# EAGLE board Mainboard_LEFT (EAGLE 9.6.2), part 1 of 3
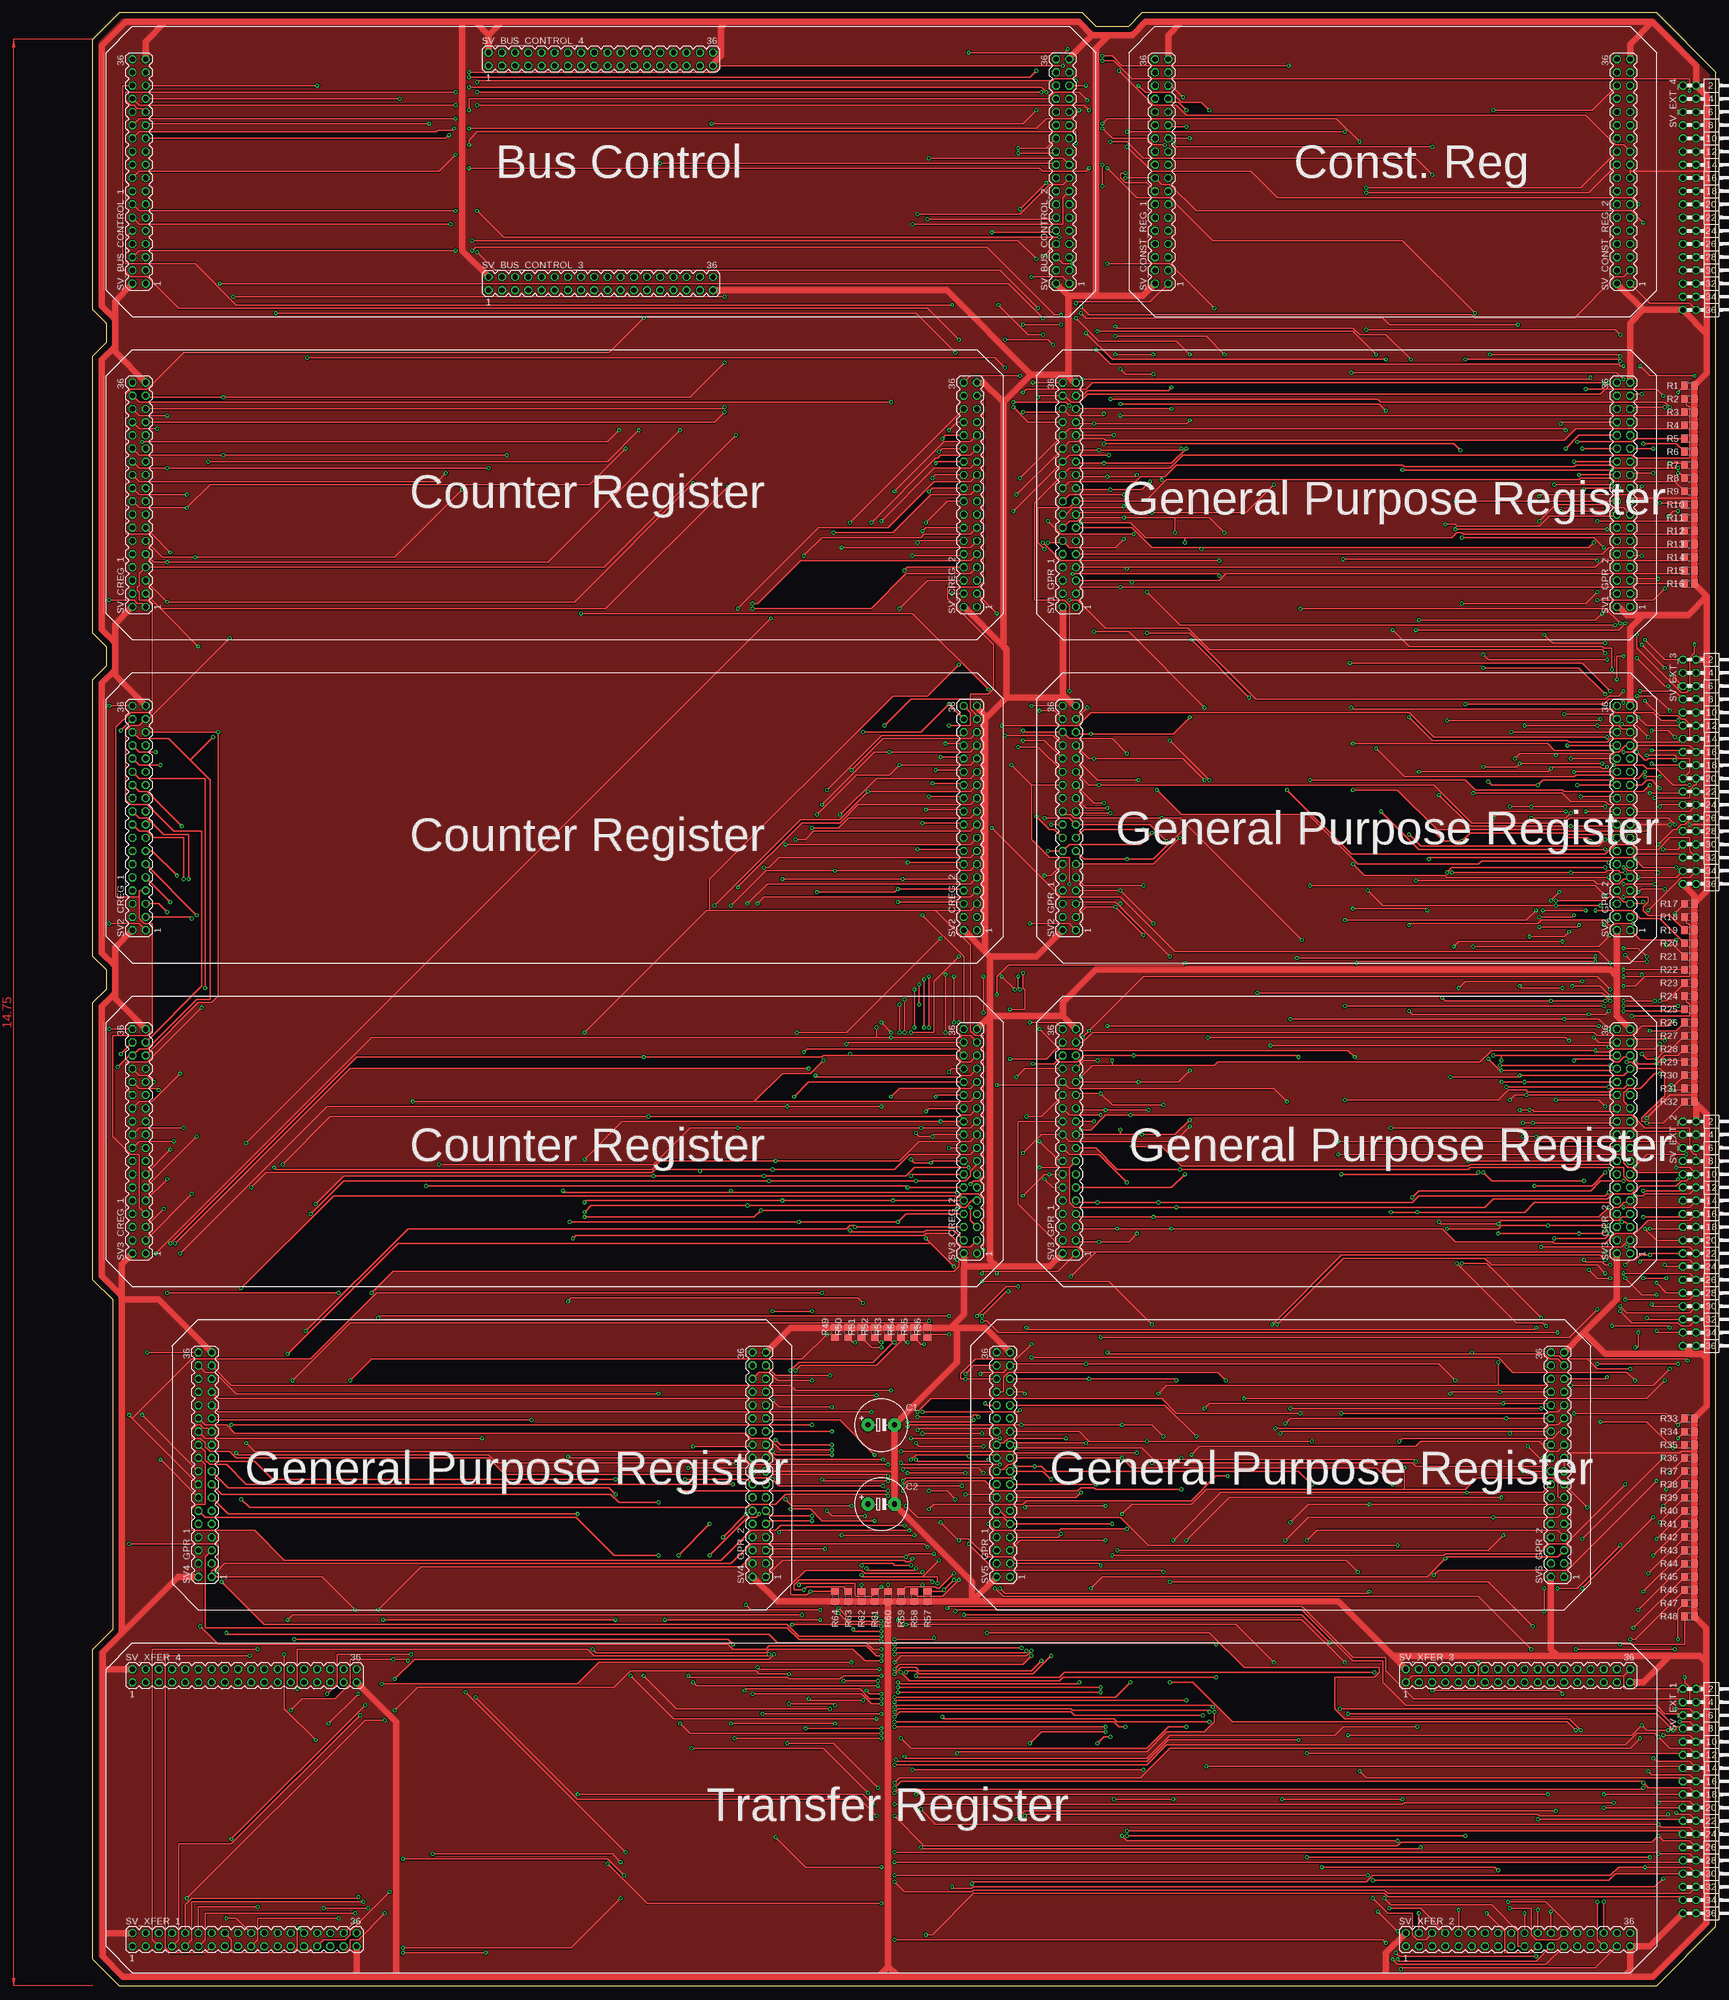
[diagram p2: board, top side]
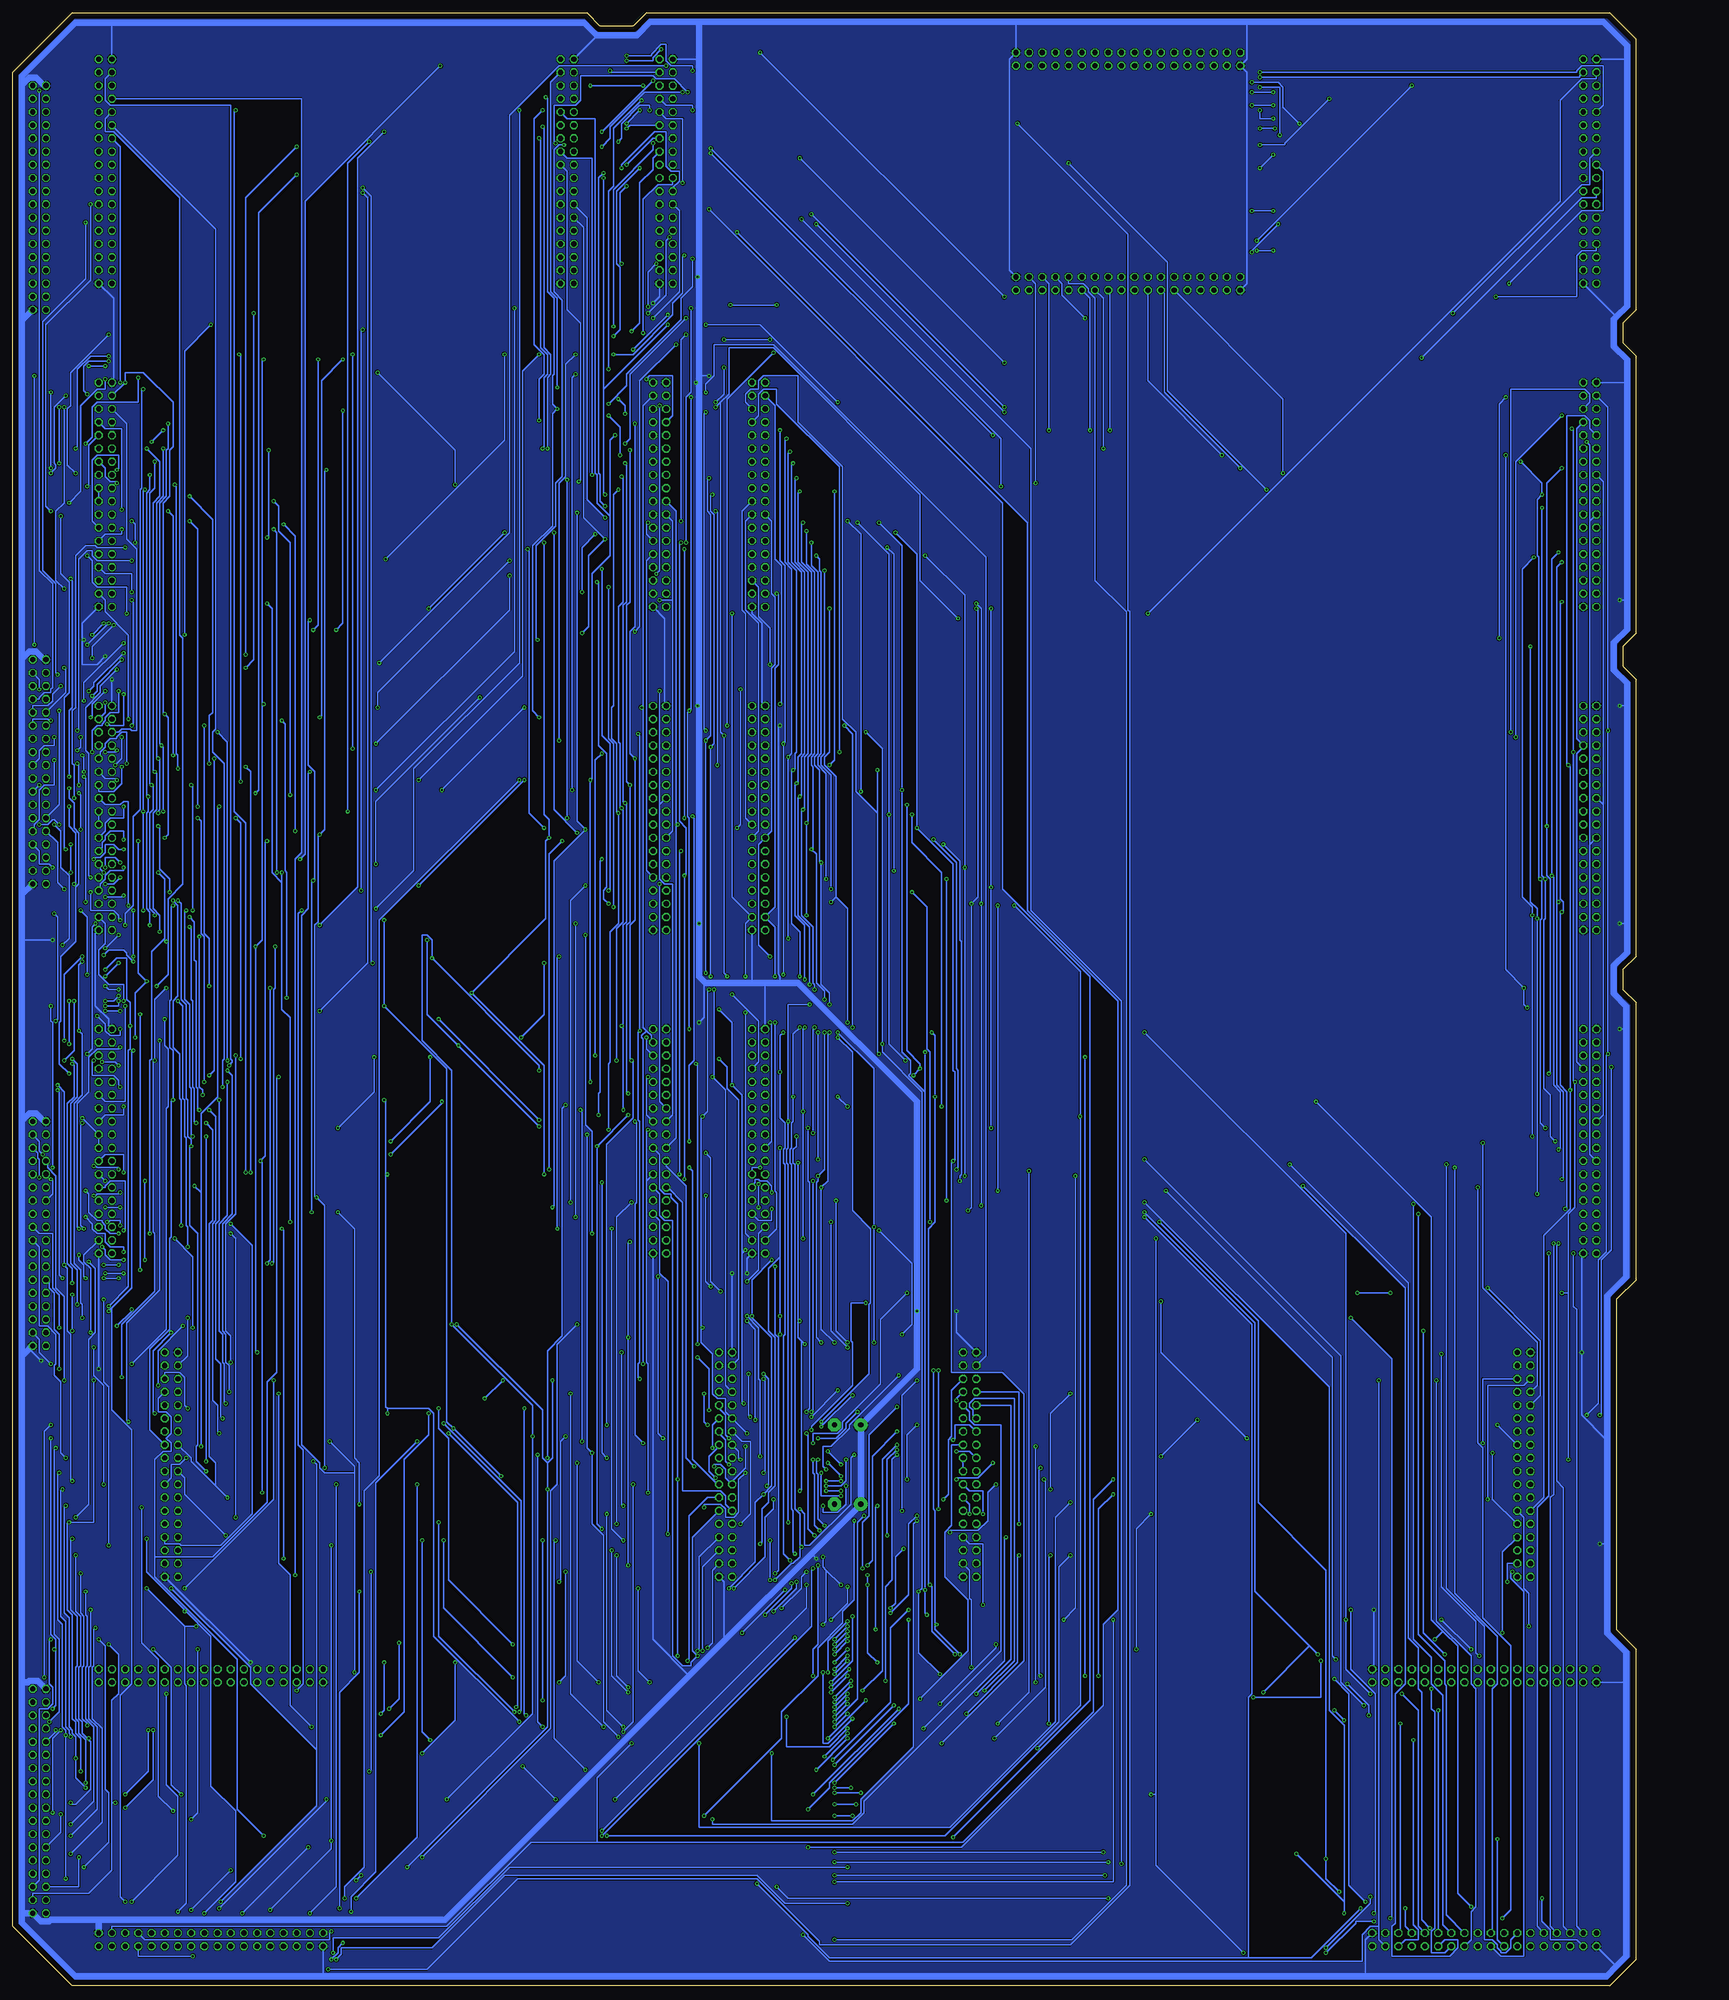
[diagram p3: board, bottom side, seen from below]

Size 312.42 x 379.73 mm. Coordinates in mm from the lower left corner, seen from the top.
Outline: 5.08,0 300.99,0 312.42,11.43 312.42,368.3 300.99,379.73 201.93,379.73 199.39,377.19 193.04,377.19 190.5,379.73 5.08,379.73 0,374.65 0,322.58 2.54,320.04 2.54,316.23 0,313.69 0,260.35 2.54,257.81 2.54,254 0,251.46 0,198.12 2.54,195.58 2.54,191.77 0,189.23 0,135.89 3.81,132.08 3.81,68.58 0,64.77 0,5.08 5.08,0
Copper layers (1*16): Top 0.035mm / dielectric 1.5mm / Bottom 0.035mm
Design rules "default *": minimum track width 10mil, minimum drill 0.35mm, track to track 6mil, track to pad 6mil, pad to pad 6mil, via to via 6mil, smd to smd 6mil, copper to edge 40mil, drill to drill 6mil, minimum pad ring 10mil, minimum via ring 8mil, stop-mask expansion 4mil, vias tented up to drill 0mil, thermal gap 10mil

## Footprints (pad centres in the part's own frame; a part is rotated, then mirrored left to right if it is on the bottom)
E5-10,5 = drill 1.016 pad 2.54: + -2.54,0 | drill 1.016 pad 2.54 octagon: - 2.54,0
R0805 = smd 1.3 x 1.5: 1 -0.95,0; 2 0.95,0
MA18-2 = drill 1.016 octagon: 1 -21.59,-1.27; 2 -21.59,1.27; 3 -19.05,-1.27; 4 -19.05,1.27; 5 -16.51,-1.27; 6 -16.51,1.27; 7 -13.97,-1.27; 8 -13.97,1.27; 9 -11.43,-1.27; 10 -11.43,1.27; 11 -8.89,-1.27; 12 -8.89,1.27; 13 -6.35,-1.27; 14 -6.35,1.27; 15 -3.81,-1.27; 16 -3.81,1.27; 17 -1.27,-1.27; 18 -1.27,1.27; 19 1.27,-1.27; 20 1.27,1.27; 21 3.81,-1.27; 22 3.81,1.27; 23 6.35,-1.27; 24 6.35,1.27; 25 8.89,-1.27; 26 8.89,1.27; 27 11.43,-1.27; 28 11.43,1.27; 29 13.97,-1.27; 30 13.97,1.27; 31 16.51,-1.27; 32 16.51,1.27; 33 19.05,-1.27; 34 19.05,1.27; 35 21.59,-1.27; 36 21.59,1.27
MA18-2W = drill 1.016 octagon: 1 -21.59,-1.27; 2 -21.59,1.27; 3 -19.05,-1.27; 4 -19.05,1.27; 5 -16.51,-1.27; 6 -16.51,1.27; 7 -13.97,-1.27; 8 -13.97,1.27; 9 -11.43,-1.27; 10 -11.43,1.27; 11 -8.89,-1.27; 12 -8.89,1.27; 13 -6.35,-1.27; 14 -6.35,1.27; 15 -3.81,-1.27; 16 -3.81,1.27; 17 -1.27,-1.27; 18 -1.27,1.27; 19 1.27,-1.27; 20 1.27,1.27; 21 3.81,-1.27; 22 3.81,1.27; 23 6.35,-1.27; 24 6.35,1.27; 25 8.89,-1.27; 26 8.89,1.27; 27 11.43,-1.27; 28 11.43,1.27; 29 13.97,-1.27; 30 13.97,1.27; 31 16.51,-1.27; 32 16.51,1.27; 33 19.05,-1.27; 34 19.05,1.27; 35 21.59,-1.27; 36 21.59,1.27

## Placement (x,y rotation side)
C1  [E5-10,5]  151.76,107.95 0 top
C2  [E5-10,5]  151.76,92.71 0 top
R1  [R0805]  307.34,307.98 0 top
R2  [R0805]  307.34,305.44 0 top
R3  [R0805]  307.34,302.89 0 top
R4  [R0805]  307.34,300.36 0 top
R5  [R0805]  307.34,297.81 0 top
R6  [R0805]  307.34,295.27 0 top
R7  [R0805]  307.34,292.74 0 top
R8  [R0805]  307.34,290.19 0 top
R9  [R0805]  307.34,287.65 0 top
R10  [R0805]  307.34,285.12 0 top
R11  [R0805]  307.34,282.57 0 top
R12  [R0805]  307.34,280.04 0 top
R13  [R0805]  307.34,277.5 0 top
R14  [R0805]  307.34,274.95 0 top
R15  [R0805]  307.34,272.42 0 top
R16  [R0805]  307.34,269.88 0 top
R17  [R0805]  307.34,208.28 0 top
R18  [R0805]  307.34,205.74 0 top
R19  [R0805]  307.34,203.2 0 top
R20  [R0805]  307.34,200.66 0 top
R21  [R0805]  307.34,198.12 0 top
R22  [R0805]  307.34,195.58 0 top
R23  [R0805]  307.34,193.04 0 top
R24  [R0805]  307.34,190.5 0 top
R25  [R0805]  307.34,187.96 0 top
R26  [R0805]  307.34,185.42 0 top
R27  [R0805]  307.34,182.88 0 top
R28  [R0805]  307.34,180.34 0 top
R29  [R0805]  307.34,177.8 0 top
R30  [R0805]  307.34,175.26 0 top
R31  [R0805]  307.34,172.72 0 top
R32  [R0805]  307.34,170.18 0 top
R33  [R0805]  307.34,109.22 0 top
R34  [R0805]  307.34,106.68 0 top
R35  [R0805]  307.34,104.14 0 top
R36  [R0805]  307.34,101.6 0 top
R37  [R0805]  307.34,99.06 0 top
R38  [R0805]  307.34,96.52 0 top
R39  [R0805]  307.34,93.98 0 top
R40  [R0805]  307.34,91.44 0 top
R41  [R0805]  307.34,88.9 0 top
R42  [R0805]  307.34,86.36 0 top
R43  [R0805]  307.34,83.82 0 top
R44  [R0805]  307.34,81.28 0 top
R45  [R0805]  307.34,78.74 0 top
R46  [R0805]  307.34,76.2 0 top
R47  [R0805]  307.34,73.66 0 top
R48  [R0805]  307.34,71.12 0 top
R49  [R0805]  142.88,125.73 90 top
R50  [R0805]  145.41,125.73 90 top
R51  [R0805]  147.96,125.73 90 top
R52  [R0805]  150.5,125.73 90 top
R53  [R0805]  153.03,125.73 90 top
R54  [R0805]  155.57,125.73 90 top
R55  [R0805]  158.12,125.73 90 top
R56  [R0805]  160.66,125.73 90 top
R57  [R0805]  160.66,74.93 270 top
R58  [R0805]  158.12,74.93 270 top
R59  [R0805]  155.57,74.93 270 top
R60  [R0805]  153.03,74.93 270 top
R61  [R0805]  150.5,74.93 270 top
R62  [R0805]  147.96,74.93 270 top
R63  [R0805]  145.41,74.93 270 top
R64  [R0805]  142.88,74.93 270 top
SV1_GPR_1  [MA18-2]  187.96,287.02 90 top
SV1_GPR_2  [MA18-2]  294.64,287.02 90 top
SV2_CREG_1  [MA18-2]  8.89,224.79 90 top
SV2_CREG_2  [MA18-2]  168.91,224.79 90 top
SV2_GPR_1  [MA18-2]  187.96,224.79 90 top
SV2_GPR_2  [MA18-2]  294.64,224.79 90 top
SV3_CREG_1  [MA18-2]  8.89,162.56 90 top
SV3_CREG_2  [MA18-2]  168.91,162.56 90 top
SV3_GPR_1  [MA18-2]  187.96,162.56 90 top
SV3_GPR_2  [MA18-2]  294.64,162.56 90 top
SV4_GPR_1  [MA18-2]  21.59,100.33 90 top
SV4_GPR_2  [MA18-2]  128.27,100.33 90 top
SV5_GPR_1  [MA18-2]  175.26,100.33 90 top
SV5_GPR_2  [MA18-2]  281.94,100.33 90 top
SV_BUS_CONTROL_1  [MA18-2]  8.89,349.25 90 top
SV_BUS_CONTROL_2  [MA18-2]  186.69,349.25 90 top
SV_BUS_CONTROL_3  [MA18-2]  97.79,327.66 0 top
SV_BUS_CONTROL_4  [MA18-2]  97.79,370.84 0 top
SV_CONST_REG_1  [MA18-2]  205.74,349.25 90 top
SV_CONST_REG_2  [MA18-2]  294.64,349.25 90 top
SV_CREG_1  [MA18-2]  8.89,287.02 90 top
SV_CREG_2  [MA18-2]  168.91,287.02 90 top
SV_EXT_1  [MA18-2W]  307.34,35.56 270 top
SV_EXT_2  [MA18-2W]  307.34,144.78 270 top
SV_EXT_3  [MA18-2W]  307.34,233.68 270 top
SV_EXT_4  [MA18-2W]  307.34,344.17 270 top
SV_XFER_1  [MA18-2]  29.21,8.89 0 top
SV_XFER_2  [MA18-2]  274.32,8.89 0 top
SV_XFER_3  [MA18-2]  274.32,59.69 0 top
SV_XFER_4  [MA18-2]  29.21,59.69 0 top

## Tracks (layer width: path | path; a pad name or v marks a point on that pad's centre or on a via)
!CLK  (via drill 0.35)
  Top 0.254: SV_CONST_REG_1.16 202.88,347.03 198.75,347.03 197.8,347.98 197.8,348.93 v198.75,348.93 | v198.44,284.8 198.12,284.48 188.59,284.48 187.32,283.21 SV1_GPR_1.16 | SV_EXT_3.7 304.48,249.24 v297.81,249.24 | v291.15,256.54 290.51,257.18 214.95,257.18 210.82,261.3 194.94,261.3 189.55,266.7 v187.96,266.7 | v6.99,109.86 7.62,109.22 | 7.62,109.22 SV4_GPR_1.16 | v4.76,176.85 6.99,179.07 SV3_CREG_1.32 8.89,180.34 10.48,180.34 20,189.87 22.54,189.87 22.54,232.09 18.73,235.9 | SV2_CREG_1.32 8.89,240.03 14.61,240.03 18.73,235.9 | SV_CREG_1.32 8.89,302.26 v14.29,302.26 | 18.73,235.9 v23.18,240.35 | v177.48,100.01 v181.29,100.01 182.56,100.01 183.51,99.06 232.09,99.06 v234.63,96.52 | SV_XFER_2.6 256.54,8.89 254.95,8.89 254,9.84 254,13.97 249.24,13.97 v246.38,16.83 | 7.62,109.22 19.05,120.65 41.91,120.65 54.61,133.35 v140.34,133.35 | v158.43,104.46 159.07,103.82 v171.45,103.82 | SV2_GPR_1.16 185.1,222.57 184.15,222.57 v181.61,225.11 | v182.25,162.56 186.06,158.75 SV3_GPR_1.16
  Bottom 0.254: SV2_GPR_1.16 185.42,222.25 185.42,266.7 | 185.42,266.7 185.42,281.94 SV1_GPR_1.16 | v198.75,348.93 199.71,347.98 199.71,291.15 199.39,290.83 199.39,285.75 v198.44,284.8 | v297.81,249.24 296.86,250.19 296.86,250.82 v291.15,256.54 | 185.42,266.7 v187.96,266.7 | v6.99,109.86 6.67,110.17 6.67,139.7 4.76,141.6 v4.76,176.85 | v14.29,302.26 23.18,293.37 v23.18,240.35 | 174.31,96.84 175.26,97.79 175.26,99.38 176.21,100.33 177.48,100.33 v177.48,100.01 | v181.29,100.01 182.88,101.6 182.88,153.99 186.69,157.8 SV3_GPR_1.16 | v246.38,16.83 234.63,28.57 v234.63,96.52 | v140.34,133.35 145.41,128.27 145.41,115.89 152.72,108.58 152.72,107.31 153.67,106.36 158.43,106.36 v158.43,104.46 | v171.45,103.82 171.45,99.69 174.31,96.84 | 174.31,96.84 SV5_GPR_1.16 | v181.61,225.11 181.29,224.79 181.29,178.12 182.25,177.16 v182.25,162.56
!CONST_REG_ASSERT_MAIN_BUS  (via drill 0.35)
  Top 0.254: v127.95,61.28 128.27,60.96 v151.45,60.96 | v193.99,57.47 v154.94,57.47 | v196.22,82.87 260.03,82.87 260.35,83.19 278.45,83.19 280.35,85.09 283.53,85.09 | 283.53,85.09 284.48,84.14 284.48,81.28 SV5_GPR_2.3 | v297.5,125.73 297.5,122.87 v296.86,122.87 | 283.53,85.09 v294.96,96.52 | v291.15,189.55 v280.67,189.55 260.35,189.55 v259.71,190.18 | v278.76,142.24 294.32,142.24 295.59,143.51 SV3_GPR_2.3 | v290.19,243.84 289.88,243.52 v260.67,243.52
  Bottom 0.254: SV4_GPR_2.3 128.27,80.01 128.27,74.61 127.95,74.3 v127.95,61.28 | v154.94,57.47 v151.45,60.96 | v193.99,57.47 196.22,59.69 v196.22,82.87 | SV3_GPR_2.3 298.77,140.65 298.77,139.38 297.5,138.11 v297.5,125.73 | v296.86,122.87 296.86,117.47 294.96,115.57 v294.96,96.52 | SV2_GPR_2.3 294.64,204.47 294.64,200.66 295.91,199.39 295.91,194.63 294,192.72 291.15,192.72 v291.15,189.55 | v280.67,189.55 279.72,188.59 279.72,170.81 279.4,170.5 279.4,163.51 279.08,163.19 279.08,146.37 278.76,146.05 v278.76,142.24 | SV1_GPR_2.3 294.64,266.7 294.64,264.48 290.19,260.03 v290.19,243.84 | v260.67,243.52 260.03,242.89 260.03,214.63 259.71,214.31 v259.71,190.18
!CONST_REG_LOAD  (via drill 0.35)
  Top 0.254: v137.79,55.24 138.11,54.93 v148.27,54.93 | v155.57,47.62 157.48,45.72 202.88,45.72 207.01,49.85 v210.5,49.85 | v211.46,102.23 213.04,103.82 254.63,103.82 255.59,104.78 278.45,104.78 280.35,102.87 281.94,102.87 SV5_GPR_2.21 | v291.15,169.23 289.88,170.5 v281.62,170.5 | v290.19,207.96 v281.62,207.96 248.28,207.96 v245.43,210.82 | SV1_GPR_2.21 296.23,291.15 v300.36,291.15 | v294,317.82 293.05,318.77 v245.11,318.77
  Bottom 0.254: SV4_GPR_2.21 131.76,104.14 131.76,88.58 133.03,87.31 133.03,78.74 128.59,74.3 128.59,64.45 v137.79,55.24 | v155.57,47.62 v148.27,54.93 | v210.5,49.85 211.46,50.8 v211.46,102.23 | SV3_GPR_2.21 294.64,167.64 291.15,167.64 v291.15,169.23 | SV5_GPR_2.21 286.07,107 286.07,122.56 282.26,126.36 282.26,143.83 281.94,144.15 281.94,170.18 v281.62,170.5 281.62,180.02 282.26,180.66 282.26,189.55 281.94,189.87 281.94,207.65 v281.62,207.96 | SV2_GPR_2.21 294.64,227.33 291.78,227.33 291.15,227.97 290.19,227.97 v290.19,207.96 | v300.36,291.15 301.94,292.74 301.94,303.53 301.31,304.17 301.31,310.51 v294,317.82 | v245.11,318.77 245.43,318.45 v245.43,210.82
!CTRL_ALU_ASSERT  (via drill 0.35)
  Top 0.254: SV_EXT_3.13 305.44,239.4 296.86,239.4 296.23,240.03 292.1,240.03 291.46,239.4 284.16,239.4 283.85,239.71 257.81,239.71 v253.37,244.16 | v248.92,313.06 196.22,313.06 v191.13,318.13
  Bottom 0.254: v253.37,244.16 253.05,244.47 253.05,308.93 v248.92,313.06 | v191.13,318.13 191.13,343.85 188.28,346.71 185.42,346.71 SV_BUS_CONTROL_2.18
!CTRL_CONST_ASSERT  (via drill 0.35)
  Top 0.254: SV_BUS_CONTROL_2.6 186.69,331.47 v188.59,331.47 | v190.18,323.21 191.77,321.63 265.43,321.63 266.06,320.99 285.12,320.99 293.05,328.93 294.64,328.93 SV_CONST_REG_2.3
  Bottom 0.254: v188.59,331.47 190.18,329.88 v190.18,323.21
!CTRL_CONST_LOAD  (via drill 0.35)
  Top 0.254: v197.49,368.62 204.15,361.95 208.6,361.95 210.5,360.05 287.34,360.05 293.05,354.33 294.64,354.33 SV_CONST_REG_2.21
  Bottom 0.254: SV_BUS_CONTROL_2.33 197.49,368.3 v197.49,368.62
!CTRL_CREG_ASSERT_ADDR  (via drill 0.35)
  Top 0.254: v14.92,160.97 SV3_CREG_1.13 | v16.19,213.68 11.43,218.44 SV2_CREG_1.13 | v14.92,275.91 11.43,279.4 | 11.43,279.4 SV_CREG_1.13 | v106.05,320.99 99.38,314.32 17.46,314.32 10.48,307.34 7.3,307.34 6.35,306.39 6.35,279.4 11.43,279.4
  Bottom 0.254: v14.92,160.97 14.61,161.29 14.61,172.09 15.88,173.35 15.88,213.36 v16.19,213.68 16.19,274.64 v14.92,275.91 | SV_BUS_CONTROL_3.30 110.49,327.66 110.49,325.44 v106.05,320.99
!CTRL_CREG_ASSERT_XFER  (via drill 0.35)
  Top 0.254: v20,163.51 SV3_CREG_1.11 | SV2_CREG_1.11 v20,206.06 | SV_CREG_1.11 13.34,274.95 v19.68,274.95 58.1,274.95 v71.12,287.97 | SV_BUS_CONTROL_2.20 185.1,350.84 v109.22,350.84
  Bottom 0.254: v20,163.51 v20,206.06 20,207.65 21.91,209.55 21.91,272.73 v19.68,274.95 | v109.22,350.84 90.17,331.79 90.17,307.02 v71.12,287.97
!CTRL_CREG_DEC  (via drill 0.35)
  Top 0.254: SV3_CREG_1.20 8.89,165.1 v17.46,165.1 | v18.41,213.04 18.41,221.62 13.65,221.62 10.48,224.79 8.89,224.79 SV2_CREG_1.20 | SV_CREG_1.20 8.89,287.02 v18.1,287.02 | v105.09,299.4 99.06,293.37 v22.23,293.37
  Bottom 0.254: v17.46,165.1 18.41,166.05 18.41,205.1 18.1,205.42 18.1,212.72 v18.41,213.04 18.73,213.36 18.73,274.95 19.05,275.27 19.05,286.07 v18.1,287.02 18.1,289.24 v22.23,293.37 | SV_BUS_CONTROL_3.25 105.09,324.8 v105.09,299.4
!CTRL_CREG_INC  (via drill 0.35)
  Top 0.254: SV3_CREG_1.26 6.35,172.72 6.35,177.8 10.48,177.8 v20.95,188.28 | v21.59,192.09 21.59,232.41 8.89,232.41 SV2_CREG_1.26 | SV_CREG_1.26 8.89,294.64 v25.08,294.64 v79.69,294.64
  Bottom 0.254: v20.95,188.28 21.59,188.91 v21.59,192.09 25.08,195.58 v25.08,294.64 | v79.69,294.64 93.98,308.93 SV_BUS_CONTROL_3.15
!CTRL_CREG_LOAD_XFER  (via drill 0.35)
  Top 0.254: SV3_CREG_1.33 20.95,192.41 20.95,222.25 15.56,222.25 10.48,227.33 7.3,227.33 6.35,228.28 6.35,241.94 6.67,241.94 7.3,242.57 8.89,242.57 SV2_CREG_1.33 10.79,243.84 v26.35,259.4 | SV_CREG_1.33 10.48,305.75 v25.08,305.75 114.94,305.75 v121.6,312.42 | SV_BUS_CONTROL_2.19 186.69,351.79 v160.97,351.79
  Bottom 0.254: v25.08,305.75 26.35,304.48 v26.35,259.4 | v121.6,312.42 v160.97,351.79
!CTRL_DPLY_ENABLE  (via drill 0.35)
  Top 0.254: SV_EXT_3.21 305.75,229.55 v299.72,229.55 | v299.4,222.57 299.08,222.25 283.53,222.25 283.21,222.57 258.76,222.57 251.14,230.19 v242.57,230.19 | v215.9,322.9 207.33,331.47 v195.26,331.47 | v194.31,350.52 v194.31,346.39
  Bottom 0.254: v299.72,229.55 299.4,229.24 v299.4,222.57 | v242.57,230.19 215.9,256.86 v215.9,322.9 | v195.26,331.47 195.58,331.79 195.58,345.12 v194.31,346.39 | v194.31,350.52 189.23,355.6 SV_BUS_CONTROL_2.23
!CTRL_IR_LOAD  (via drill 0.35)
  Top 0.254: v194.31,357.5 196.22,355.6 202.88,355.6 204.15,354.33 v206.38,354.33 | v222.57,247.97 v211.46,259.08 | v242.57,215.9 244.79,213.68 260.35,213.68 260.67,213.36 v291.78,213.36 | v300.67,212.09 v294.64,212.09 | v301.62,227.01 301.94,227.33 SV_EXT_3.23
  Bottom 0.254: SV_BUS_CONTROL_2.25 193.68,358.14 v194.31,357.5 | v206.38,354.33 207.33,354.33 208.28,353.38 208.28,326.07 206.69,324.49 206.69,290.51 207.96,289.24 207.96,280.99 211.77,277.18 211.77,259.4 v211.46,259.08 | v222.57,247.97 242.57,227.97 v242.57,215.9 | v291.78,213.36 293.05,212.09 v294.64,212.09 | v300.67,212.09 300.36,212.41 300.36,221.93 301.62,223.2 v301.62,227.01
!CTRL_PC_ASSERT_ADDR  (via drill 0.35)
  Top 0.254: v13.65,149.54 SV3_CREG_1.5 | v14.29,206.69 12.7,208.28 SV2_CREG_1.5 | SV_CREG_1.5 v14.29,266.38 92.71,266.38 v115.57,289.24
  Bottom 0.254: v13.65,149.54 13.34,149.86 13.34,172.09 14.61,173.35 14.61,206.38 v14.29,206.69 13.97,207.01 13.97,208.6 14.61,209.23 14.61,266.06 v14.29,266.38 | SV_BUS_CONTROL_3.34 115.57,327.66 v115.57,289.24
!CTRL_PC_ASSERT_XFER  (via drill 0.35)
  Top 0.254: v19.05,152.4 SV3_CREG_1.3 | v19.05,205.42 18.73,205.74 SV2_CREG_1.3 | v20.32,257.81 13.02,265.11 | 13.02,265.11 SV_CREG_1.3 | SV_BUS_CONTROL_2.24 183.51,353.69 v178.12,353.69 | v122.24,288.61 98.74,265.11 13.02,265.11
  Bottom 0.254: v19.05,152.4 v19.05,205.42 19.05,207.33 20.32,208.6 v20.32,257.81 | v178.12,353.69 122.24,297.81 v122.24,288.61
!CTRL_PC_DEC  (via drill 0.35)
  Top 0.254: v101.28,299.4 99.06,297.18 v9.53,297.18
  Bottom 0.254: SV3_CREG_1.16 8.89,160.02 8.89,219.71 | SV2_CREG_1.16 8.89,219.71 | 8.89,281.94 SV_CREG_1.16 | 8.89,219.71 8.89,281.94 | SV_BUS_CONTROL_3.21 101.28,326.07 v101.28,299.4 | v9.53,297.18 8.89,296.55 8.89,281.94
!CTRL_PC_INC  (via drill 0.35)
  Top 0.254: v67.94,291.15 66.36,289.56 8.89,289.56 SV_CREG_1.22
  Bottom 0.254: SV3_CREG_1.22 6.35,167.64 6.35,227.33 | SV2_CREG_1.22 6.35,227.33 | SV_CREG_1.22 6.35,289.56 6.35,227.33 | SV_BUS_CONTROL_3.11 67.94,305.44 v67.94,291.15
!CTRL_PC_LOAD_XFER  (via drill 0.35)
  Top 0.254: SV_BUS_CONTROL_2.15 186.69,344.17 186.69,339.09 v157.8,339.09 | v121.6,302.89 119.7,300.99 SV_CREG_1.29
  Bottom 0.254: SV3_CREG_1.29 11.43,177.8 11.43,237.17 10.16,238.44 SV2_CREG_1.29 11.43,240.03 11.43,299.72 SV_CREG_1.29 | v121.6,302.89 v157.8,339.09
!CTRL_RAM_ASSERT_MAIN  (via drill 0.35)
  Top 0.254: SV_EXT_3.15 305.75,237.81 v300.04,237.81 | v299.4,240.35 297.18,242.57 294.64,242.57 v294.32,242.89 | v291.15,248.6 286.07,253.68 v267.65,253.68 | v266.06,321.94 252.09,335.92 215.58,335.92 207.33,344.17 200.98,344.17 v195.26,349.88
  Bottom 0.254: v300.04,237.81 299.4,238.44 v299.4,240.35 | v294.32,242.89 294,242.89 293.69,242.57 291.15,242.57 v291.15,248.6 | v267.65,253.68 266.06,255.27 v266.06,321.94 | v195.26,349.88 195.26,350.52 188.91,356.87 186.69,356.87 186.69,350.2 185.74,349.25 184.15,349.25 184.15,347.35 185.42,346.07 SV_BUS_CONTROL_2.16
!CTRL_RAM_LOAD_MAIN  (via drill 0.35)
  Top 0.254: SV_EXT_3.19 307.34,233.68 307.34,236.22 305.12,236.22 304.48,236.85 v299.08,236.85 | v298.77,233.68 297.5,232.41 293.05,232.41 292.42,233.04 285.43,233.04 285.12,232.73 252.41,232.73 v247.01,238.12 | v247.01,314.01 242.57,318.45 v193.36,318.45
  Bottom 0.254: v299.08,236.85 298.77,236.54 v298.77,233.68 | v247.01,314.01 v247.01,238.12 | v193.36,318.45 191.77,320.04 191.77,347.03 189.23,349.57 189.23,351.79 SV_BUS_CONTROL_2.21
!CTRL_SP_ASSERT_ADDR  (via drill 0.35)
  Top 0.254: v14.29,155.26 SV3_CREG_1.9 | SV2_CREG_1.9 v14.92,208.6 | SV_CREG_1.9 11.75,274 v14.29,274 87.63,274 v113.03,299.4
  Bottom 0.254: v14.29,155.26 13.97,155.57 13.97,172.09 15.24,173.35 15.24,208.28 | v14.92,208.6 15.24,208.28 | v14.29,274 15.24,273.05 15.24,208.28 | SV_BUS_CONTROL_3.32 113.03,327.66 v113.03,299.4
!CTRL_SP_ASSERT_XFER  (via drill 0.35)
  Top 0.254: SV3_CREG_1.7 8.89,149.86 8.89,160.02 7.3,160.02 3.81,163.51 3.81,182.88 10.48,182.88 11.43,183.83 11.43,204.47 9.84,204.47 8.89,205.42 8.89,209.55 | 8.89,209.55 8.89,210.82 SV2_CREG_1.7 | 8.89,209.55 4.45,209.55 4.45,242.25 7.3,245.11 11.43,245.11 11.43,265.75 10.48,266.7 8.89,266.7 8.89,268.29 8.57,268.61 8.57,269.24 8.89,269.56 8.89,271.78 SV_CREG_1.7 98.42,273.05 v123.83,298.45 | SV_BUS_CONTROL_2.22 185.1,352.74 v178.12,352.74
  Bottom 0.254: v123.83,298.45 v178.12,352.74
!CTRL_SP_DEC  (via drill 0.35)
  Top 0.254: SV3_CREG_1.18 8.89,162.56 v15.56,162.56 | v17.46,213.04 17.46,220.98 11.75,220.98 10.48,222.25 8.89,222.25 SV2_CREG_1.18 | SV_CREG_1.18 8.89,284.48 v18.1,284.48 22.54,288.93 95.57,288.93 v102.55,295.91
  Bottom 0.254: v15.56,162.56 16.51,163.51 16.51,171.45 17.78,172.72 17.78,205.1 17.46,205.42 v17.46,213.04 18.1,213.68 v18.1,284.48 | SV_BUS_CONTROL_3.23 102.55,324.8 v102.55,295.91
!CTRL_SP_INC  (via drill 0.35)
  Top 0.254: SV3_CREG_1.24 8.89,170.18 11.43,170.18 v16.83,175.58 | v17.14,223.2 10.48,229.87 8.89,229.87 SV2_CREG_1.24 | SV_CREG_1.24 8.89,292.1 v14.29,292.1 v76.2,292.1
  Bottom 0.254: v16.83,175.58 16.51,175.9 16.51,213.04 17.14,213.68 v17.14,223.2 17.14,289.24 v14.29,292.1 | SV_BUS_CONTROL_3.13 90.81,325.75 90.81,306.7 v76.2,292.1
!CTRL_SP_LOAD_XFER  (via drill 0.35)
  Top 0.254: SV3_CREG_1.31 20.32,189.23 22.86,189.23 24.13,190.5 v24.13,241.3 SV2_CREG_1.31 | SV_BUS_CONTROL_2.17 186.69,346.71 184.15,346.71 178.44,341 v158.75,341 | v121.6,303.85 121.28,303.53 SV_CREG_1.31
  Bottom 0.254: SV_CREG_1.31 8.89,304.8 8.89,306.39 9.84,307.34 24.13,307.34 v24.13,241.3 | v121.6,303.85 v158.75,341
!CTRL_XFER_ASSERT_ADDR  (via drill 0.35)
  Top 0.254: SV_XFER_2.23 277.81,4.76 251.46,4.76 v251.14,5.08 | v248.92,8.26 248.28,8.89 v154.31,8.89
  Bottom 0.254: v251.14,5.08 249.87,6.35 249.87,7.3 v248.92,8.26 | v154.31,8.89 108.58,8.89 98.11,19.37 98.11,264.48 104.14,270.51 104.14,324.8 105.41,326.07 105.41,326.71 106.36,327.66 109.22,327.66 SV_BUS_CONTROL_3.28
!CTRL_XFER_ASSERT_XFER  (via drill 0.35)
  Top 0.254: SV_BUS_CONTROL_2.12 185.1,340.04 v160.66,340.04 | v99.06,23.5 106.68,15.88 v151.76,15.88 | v250.19,5.08 251.14,4.13 279.72,4.13 SV_XFER_2.25
  Bottom 0.254: v160.66,340.04 116.52,295.91 116.52,207.01 99.06,189.55 v99.06,23.5 | v151.76,15.88 163.83,15.88 169.23,21.27 217.81,21.27 231.78,7.3 249.24,7.3 249.24,6.03 v250.19,5.08
!CTRL_XFER_L_ASSERT  (via drill 0.35)
  Top 0.254: v183.2,333.06 SV_BUS_CONTROL_2.8 | v204.15,314.01 v196.85,314.01 | v214.95,232.09 v207.33,239.71 | v248.6,16.83 249.87,15.56 269.24,15.56 274.32,10.48 274.32,7.62 SV_XFER_2.19
  Bottom 0.254: v183.2,333.06 183.51,332.74 183.51,325.75 185.42,323.85 185.42,321.63 193.04,314.01 v196.85,314.01 | v204.15,314.01 206.06,312.1 206.06,290.51 207.33,289.24 v207.33,239.71 | v214.95,232.09 241.94,205.1 241.94,98.11 244.79,95.25 244.79,22.86 248.6,19.05 v248.6,16.83
!CTRL_XFER_L_LOAD  (via drill 0.35)
  Top 0.254: SV_XFER_2.31 289.56,8.89 v289.56,16.19 | v282.89,56.2 282.26,56.83 v257.81,56.83 | v256.86,207.01 256.54,207.33 v242.57,207.33 | v214.95,361 213.36,362.58 209.55,362.58 207.65,364.49 202.56,364.49 v201.29,365.76 | SV_BUS_CONTROL_2.31 v191.13,365.76
  Bottom 0.254: v289.56,16.19 280.67,25.08 280.67,36.51 282.89,38.73 v282.89,56.2 | v257.81,56.83 256.54,58.1 256.54,103.19 257.49,104.14 257.49,206.38 v256.86,207.01 | v242.57,207.33 235.27,214.63 235.27,234.31 214.95,254.63 v214.95,361 | v191.13,365.76 v201.29,365.76
!CTRL_XFER_LOAD_XFER  (via drill 0.35)
  Top 0.254: v178.44,341.95 v183.51,347.03 | v131.44,28.57 137.16,22.86 v151.76,22.86 | v250.82,6.35 251.46,5.71 v277.81,5.71
  Bottom 0.254: SV_BUS_CONTROL_2.27 186.69,359.41 183.51,359.41 v183.51,347.03 | v178.44,341.95 121.92,285.43 121.92,211.14 105.09,194.31 105.09,54.93 v131.44,28.57 | v151.76,22.86 216.85,22.86 230.5,9.21 250.82,9.21 v250.82,6.35 | v277.81,5.71 288.29,5.71 SV_XFER_2.29
!CTRL_XFER_R_ASSERT  (via drill 0.35)
  Top 0.254: SV_BUS_CONTROL_2.10 185.1,337.5 v173.04,337.5 | v159.38,26.67 159.7,26.35 255.27,26.35 v255.59,26.67 | v268.29,13.97 271.78,10.48 271.78,6.35 276.86,6.35 SV_XFER_2.21
  Bottom 0.254: v173.04,337.5 117.16,281.62 117.16,207.01 99.69,189.55 99.69,72.39 102.55,69.53 102.55,53.98 129.86,26.67 v159.38,26.67 | v268.29,13.97 v255.59,26.67
!CTRL_XFER_R_LOAD  (via drill 0.35)
  Top 0.254: v181.61,361 179.07,358.46 v119.06,358.46 | v251.78,3.17 252.09,3.49 289.24,3.49 SV_XFER_2.33
  Bottom 0.254: SV_BUS_CONTROL_2.29 186.69,361.95 181.61,361.95 v181.61,361 | v119.06,358.46 97.79,337.19 97.79,264.8 97.47,264.48 97.47,19.37 108.9,7.94 157.16,7.94 157.16,8.57 169.23,20.64 215.26,20.64 232.73,3.17 v251.78,3.17
!GPR_A_ALU_LEFT_ASSERT  (via drill 0.35)
  Top 0.254: v278.76,128.59 268.29,139.06 v263.52,139.06 | v262.89,192.09 264.16,193.36 v286.7,193.36 | v288.93,182.56 289.88,181.61 SV3_GPR_2.34 | v179.07,306.7 179.71,307.34 191.13,307.34 192.41,308.61 v290.83,308.61 | SV2_GPR_2.34 292.42,244.79 v283.21,244.79 | v288.29,220.34 287.65,220.98 v283.21,220.98
  Bottom 0.254: SV5_GPR_2.34 278.76,121.28 v278.76,128.59 | v263.52,139.06 262.89,139.7 v262.89,192.09 | v288.93,182.56 288.93,191.13 v286.7,193.36 288.29,194.94 v288.29,220.34 | SV4_GPR_2.34 125.09,121.28 125.09,274.95 166.05,315.91 177.48,315.91 177.48,309.88 179.07,308.29 v179.07,306.7 | SV1_GPR_2.34 v290.83,308.61 290.83,310.51 287.34,310.51 281.62,304.8 281.62,296.23 282.26,295.59 282.26,286.7 283.53,285.43 283.53,245.11 v283.21,244.79 282.57,244.16 282.57,221.62 v283.21,220.98
!GPR_A_ALU_RIGHT_ASSERT  (via drill 0.35)
  Top 0.254: v285.75,231.14 SV2_GPR_2.24 | SV1_GPR_2.24 v285.12,293.37 | v131.44,105.09 132.4,104.14 v142.24,104.14 | v148.91,56.83 149.54,56.2 v151.76,56.2 | v154.31,53.66 154.62,53.98 215.26,53.98 v215.58,53.66 | v228.6,106.36 228.92,106.68 272.73,106.68 | SV5_GPR_2.24 272.73,106.68 | SV3_GPR_2.24 292.74,168.28 277.5,168.28 277.18,168.59 v276.54,168.59 v274.64,168.59 | 272.73,106.68 v272.73,106.36 | v285.12,206.06 284.8,205.74 v278.45,205.74
  Bottom 0.254: v285.12,293.37 285.12,288.29 286.07,287.34 286.07,231.46 v285.75,231.14 285.43,230.82 285.43,226.38 286.07,225.74 286.07,207.33 285.12,206.38 v285.12,206.06 | SV4_GPR_2.24 128.27,107.95 131.13,107.95 131.13,105.41 v131.44,105.09 | v142.24,104.14 145.1,101.28 145.1,60.64 v148.91,56.83 | v154.31,53.66 v151.76,56.2 | v215.58,53.66 215.26,53.98 215.26,93.03 v228.6,106.36 | v274.64,168.59 273.37,167.32 273.37,147.32 274,146.69 274,112.71 273.05,111.76 273.05,106.68 v272.73,106.36 | v278.45,205.74 277.5,204.79 277.5,197.49 277.18,197.17 277.18,173.04 276.86,172.72 276.86,168.91 v276.54,168.59
!GPR_A_ASSERT_MAIN_BUS  (via drill 0.35)
  Top 0.254: v121.28,86.36 v125.73,90.81 | v177.8,32.07 179.39,33.66 v281.62,33.66 | SV5_GPR_2.15 v287.65,92.08 | v291.15,156.53 288.61,153.99 v277.5,153.99 | v276.23,103.82 278.45,101.6 v279.08,101.6 | v272.73,227.01 v276.86,227.01 v291.15,227.01 | SV1_GPR_2.15 294.64,284.48 292.1,284.48 291.46,285.12 281.62,285.12 v278.45,281.94
  Bottom 0.254: SV4_GPR_2.15 128.27,95.25 125.73,95.25 v125.73,90.81 | v121.28,86.36 121.6,86.04 121.6,62.55 148.59,35.56 148.59,33.34 150.81,31.11 177.8,31.11 v177.8,32.07 | v281.62,33.66 284.48,36.51 284.48,62.87 287.65,66.04 v287.65,92.08 | SV3_GPR_2.15 294.64,160.02 291.15,160.02 v291.15,156.53 | 276.23,152.72 v277.5,153.99 | v276.23,103.82 276.23,152.72 | v279.08,101.6 280.35,100.33 281.94,100.33 281.94,97.79 SV5_GPR_2.15 | SV2_GPR_2.15 294.64,222.25 294.64,223.84 293.69,224.79 291.15,224.79 v291.15,227.01 | v272.73,227.01 273.05,226.69 273.05,171.13 276.23,167.96 276.23,152.72 | v278.45,281.94 276.86,280.35 v276.86,227.01
!GPR_A_LOAD  (via drill 0.35)
  Top 0.254: SV4_GPR_2.33 131.44,117.47 v141.92,117.47 | v155.89,99.38 156.21,99.69 170.5,99.69 v171.45,98.74 | v179.39,92.08 179.71,92.39 v194.94,92.39 | v195.26,121.92 195.58,121.6 265.43,121.6 | 265.43,121.6 279.4,121.6 280.35,120.65 281.94,120.65 SV5_GPR_2.33 | SV3_GPR_2.33 296.55,182.25 302.26,182.25 v302.58,181.93 | v299.08,198.12 297.5,199.71 v294.64,199.71 | v292.1,202.25 289.88,200.03 v265.75,200.03 | 265.43,121.6 v265.43,121.92 | v294.64,247.01 294,247.65 291.78,247.65 290.83,246.7 v264.16,246.7 | SV1_GPR_2.33 296.23,306.39 v298.13,306.39 | v294,312.74 293.69,313.06 v264.16,313.06
  Bottom 0.254: v141.92,117.47 151.45,107.95 151.45,107.31 154.94,103.82 156.53,103.82 156.53,100.01 v155.89,99.38 | v171.45,98.74 172.72,97.47 172.72,91.12 173.67,90.17 175.26,90.17 175.26,91.76 176.21,92.71 179.39,92.71 v179.39,92.08 | v194.94,92.39 195.26,92.71 v195.26,121.92 | v302.58,181.93 302.58,194.63 v299.08,198.12 | v292.1,202.25 v294.64,199.71 | v265.43,121.92 265.75,122.24 v265.75,200.03 264.48,201.29 264.48,246.38 | SV2_GPR_2.33 294.64,245.11 v294.64,247.01 | 264.48,246.38 v264.16,246.7 | v298.13,306.39 298.77,307.02 298.77,311.79 297.81,312.74 v294,312.74 | v264.16,313.06 264.48,312.74 264.48,246.38
!GPR_B_ALU_LEFT_ASSERT  (via drill 0.35)
  Top 0.254: SV4_GPR_2.32 128.27,118.11 130.18,118.11 131.76,116.52 v138.43,116.52 | v141.29,91.44 142.24,90.49 v148.59,90.49 | v154.31,50.8 196.53,50.8 197.49,49.85 v198.75,49.85 | v205.1,113.98 206.69,115.57 270.51,115.57 | 270.51,115.57 279.4,115.57 SV5_GPR_2.32 | v269.56,179.07 271.14,179.07 | 271.14,179.07 SV3_GPR_2.32 | 270.51,115.57 v270.51,120.02 | v273.05,241.3 SV2_GPR_2.32 | 271.14,179.07 v271.14,178.12
  Bottom 0.254: SV2_GPR_2.32 292.1,241.3 291.46,241.94 289.88,241.94 289.56,241.62 288.61,241.62 288.61,276.54 290.51,278.45 290.51,300.67 SV1_GPR_2.32 | v138.43,116.52 141.29,113.67 v141.29,91.44 | v148.59,90.49 149.86,89.22 149.86,55.24 v154.31,50.8 | v198.75,49.85 205.1,56.2 v205.1,113.98 | v269.56,179.07 269.56,148.59 271.46,146.69 271.46,126.05 270.51,125.09 v270.51,120.02 | v273.05,241.3 271.14,239.4 v271.14,178.12
!GPR_B_ALU_RIGHT_ASSERT  (via drill 0.35)
  Top 0.254: SV2_GPR_2.22 293.05,228.92 v286.38,228.92 | SV1_GPR_2.22 v286.07,290.83 | SV4_GPR_2.22 126.68,103.82 v115.57,103.82 | v115.57,58.42 116.2,57.78 v151.13,57.78 | v154.31,54.61 154.62,54.93 v210.5,54.93 | v210.5,85.72 218.76,93.98 v271.14,93.98 | SV3_GPR_2.22 293.05,166.05 v277.18,166.05 v275.27,166.05 | v286.07,204.15 285.75,203.84 v278.45,203.84
  Bottom 0.254: v286.07,290.83 286.07,287.97 286.7,287.34 286.7,229.24 v286.38,228.92 286.38,226.06 286.7,225.74 286.7,207.33 286.07,206.69 v286.07,204.15 | v115.57,58.42 v115.57,103.82 | v154.31,54.61 v151.13,57.78 | v210.5,85.72 v210.5,54.93 | 273.37,96.2 278.13,100.97 278.13,101.6 SV5_GPR_2.22 | 273.37,96.2 v271.14,93.98 | v275.27,166.05 274,164.78 274,147.32 274.64,146.69 274.64,101.92 273.37,100.65 273.37,96.2 | v278.45,203.84 278.13,203.52 278.13,189.87 277.81,189.55 277.81,173.04 277.5,172.72 277.5,166.37 v277.18,166.05
!GPR_B_ASSERT_MAIN_BUS  (via drill 0.35)
  Top 0.254: v128.27,90.81 127.64,90.17 126.05,90.17 v118.75,82.87 | v151.76,52.39 v128.91,52.39 | v194.94,49.85 v154.31,49.85 | v198.12,90.81 200.03,92.71 211.46,92.71 214.31,95.57 252.41,95.57 | 252.41,95.57 264.16,95.57 266.38,97.79 280.99,97.79 281.94,96.84 281.94,93.98 SV5_GPR_2.13 | v294.64,154.94 290.19,154.94 288.29,153.03 255.27,153.03 v254,151.76 | 252.41,95.57 v252.41,99.69 | v291.15,220.66 289.88,219.39 255.59,219.39 v253.37,221.62 | v252.09,291.78 v292.42,291.78
  Bottom 0.254: SV4_GPR_2.13 128.27,92.71 v128.27,90.81 | v118.75,82.87 119.06,82.55 119.06,62.23 v128.91,52.39 | v154.31,49.85 v151.76,52.39 | v194.94,49.85 198.12,53.02 v198.12,90.81 | v294.64,154.94 SV3_GPR_2.13 | v252.41,99.69 252.41,150.18 v254,151.76 254.32,152.08 254.32,204.15 253.68,204.79 253.68,221.3 v253.37,221.62 252.41,222.57 252.41,291.46 v252.09,291.78 | SV2_GPR_2.13 295.27,219.07 295.27,220.03 294.64,220.66 294.64,221.3 293.69,222.25 291.15,222.25 v291.15,220.66 | SV1_GPR_2.13 297.18,281.94 297.18,293.69 296.23,294.64 292.1,294.64 292.1,292.1 v292.42,291.78
!GPR_B_LOAD  (via drill 0.35)
  Top 0.254: v133.35,93.66 134.62,92.39 v146.05,92.39 | v146.37,68.58 146.69,68.26 v151.76,68.26 | v154.31,65.72 154.62,66.04 215.9,66.04 v216.22,65.72 | v278.76,111.12 v230.5,111.12 | SV3_GPR_2.31 295.59,178.75 294.64,178.75 293.69,177.8 293.05,177.8 292.42,178.44 285.43,178.44 v285.12,178.12 | v291.46,117.16 291.15,116.84 SV5_GPR_2.31 | SV2_GPR_2.31 295.27,241.94 294.32,241.94 293.69,242.57 v289.56,242.57 v275.59,242.57 | v274.64,192.41 274.95,192.09 v282.89,192.09 | SV1_GPR_2.31 296.23,303.85 v302.58,303.85 | v302.58,268.92 300.36,266.7 v289.56,266.7
  Bottom 0.254: SV4_GPR_2.31 131.76,114.62 131.76,105.73 132.4,105.09 132.4,94.61 v133.35,93.66 | v146.05,92.39 146.37,92.08 v146.37,68.58 | v154.31,65.72 v151.76,68.26 | v216.22,65.72 228.6,78.11 228.6,105.41 230.5,107.31 v230.5,111.12 | v278.76,111.12 279.4,111.76 279.4,117.16 280.35,118.11 283.21,118.11 SV5_GPR_2.31 | v291.46,117.16 291.46,127.32 285.12,133.67 285.12,144.78 285.43,145.1 285.43,177.8 v285.12,178.12 285.12,189.87 v282.89,192.09 | v275.59,242.57 275.59,202.56 274.64,201.61 v274.64,192.41 | v302.58,303.85 302.58,285.43 304.17,283.85 304.17,270.51 v302.58,268.92 | v289.56,266.7 289.24,266.38 289.24,242.89 v289.56,242.57
!GPR_C_ALU_LEFT_ASSERT  (via drill 0.35)
  Top 0.254: v283.85,238.76 SV2_GPR_2.30 | v282.57,300.67 282.89,300.99 SV1_GPR_2.30 | v112.71,82.87 v118.75,88.9 | v113.03,50.48 114.94,48.58 v151.76,48.58 | v156.21,44.13 156.53,43.81 202.88,43.81 207.33,48.26 239.08,48.26 240.66,49.85 v254.95,49.85 | v261.3,113.98 261.62,114.3 v270.83,114.3 SV5_GPR_2.30 | SV3_GPR_2.30 293.05,176.21 v271.14,176.21 270.83,176.21 v268.61,178.44 | v283.53,226.06 270.83,226.06 v269.56,224.79
  Bottom 0.254: v282.57,300.67 282.57,295.91 282.89,295.59 282.89,286.7 284.16,285.43 284.16,239.08 v283.85,238.76 283.53,238.44 v283.53,226.06 | SV4_GPR_2.30 118.75,114.3 v118.75,88.9 | v112.71,82.87 113.03,82.55 v113.03,50.48 | v156.21,44.13 v151.76,48.58 | v254.95,49.85 259.08,53.98 259.08,79.06 261.3,81.28 v261.3,113.98 | v271.14,176.21 270.19,175.26 270.19,148.59 272.1,146.69 272.1,126.05 271.46,125.41 271.46,120.02 270.83,119.38 v270.83,114.3 | v269.56,224.79 268.61,223.84 v268.61,178.44
!GPR_C_ALU_RIGHT_ASSERT  (via drill 0.35)
  Top 0.254: v287.34,226.06 SV2_GPR_2.20 | v287.02,287.97 287.34,288.29 SV1_GPR_2.20 | v130.81,102.87 131.44,102.23 v142.24,102.23 | v151.13,58.74 v144.46,58.74 | v154.31,55.56 196.85,55.56 v199.71,58.42 | v203.84,100.65 254,100.65 254.63,100.01 275.27,100.01 | 275.27,100.01 279.08,100.01 SV5_GPR_2.20 | SV3_GPR_2.20 293.05,163.51 v277.81,163.51 v275.27,163.51 | 275.27,100.01 v275.27,100.97 | v279.08,207.01 v287.34,207.01
  Bottom 0.254: v287.02,287.97 287.34,287.65 v287.34,226.06 v287.34,207.01 | SV4_GPR_2.20 128.27,102.87 v130.81,102.87 | v142.24,102.23 143.19,101.28 143.19,78.11 144.46,76.83 v144.46,58.74 | v154.31,55.56 v151.13,58.74 | v199.71,58.42 203.84,62.55 v203.84,100.65 | v275.27,100.97 v275.27,163.51 | v279.08,207.01 279.4,206.69 279.4,189.87 278.45,188.91 278.45,173.04 278.13,172.72 278.13,163.83 v277.81,163.51
!GPR_C_ASSERT_MAIN_BUS  (via drill 0.35)
  Top 0.254: SV4_GPR_2.11 130.49,90.49 v138.43,90.49 | v143.51,71.75 145.1,70.17 v151.76,70.17 | v155.57,60.33 157.16,58.74 186.06,58.74 186.69,59.37 v216.22,59.37 | v229.55,85.72 234,90.17 v269.56,90.17 281.94,90.17 SV5_GPR_2.11 | v291.15,145.41 290.51,144.78 v286.07,144.78 v270.51,144.78 | v294.96,214.31 294,214.31 293.69,214.63 291.46,214.63 291.15,214.31 v284.48,214.31 v261.62,214.31 | v262.25,280.35 v291.46,280.35
  Bottom 0.254: v138.43,90.49 140.02,88.9 140.02,75.25 v143.51,71.75 | v151.76,70.17 155.57,66.36 v155.57,60.33 | v216.22,59.37 229.55,72.71 v229.55,85.72 | SV3_GPR_2.11 294.64,153.67 294.64,153.99 293.69,154.94 290.83,154.94 290.83,145.73 v291.15,145.41 | v270.51,144.78 269.56,143.83 v269.56,90.17 | SV2_GPR_2.11 295.59,215.58 295.59,214.95 v294.96,214.31 | v284.48,214.31 283.21,213.04 283.21,201.61 285.75,199.07 285.75,178.44 286.07,178.12 v286.07,144.78 | SV1_GPR_2.11 294.64,279.4 291.46,279.4 v291.46,280.35 | v262.25,280.35 261.62,279.72 v261.62,214.31
!GPR_C_LOAD  (via drill 0.35)
  Top 0.254: SV3_GPR_2.29 294.64,175.26 v274.64,175.26 274.32,174.94 v261.3,174.94 | v273.69,236.22 274.64,237.17 281.62,237.17 | 281.62,237.17 292.1,237.17 292.42,236.85 293.05,237.49 293.69,237.49 294.96,238.76 SV2_GPR_2.29 | v291.46,284.16 291.15,283.85 v282.57,283.85 | 281.62,237.17 v281.62,236.85 | v130.81,112.71 132.08,111.44 v142.24,111.44 | v148.91,80.33 149.22,80.01 158.12,80.01 v158.43,80.33 | v264.16,28.89 v199.07,28.89
  Bottom 0.254: v274.64,175.26 273.69,176.21 v273.69,236.22 | SV1_GPR_2.29 294.64,299.72 291.46,299.72 v291.46,284.16 | v282.57,283.85 281.62,282.89 v281.62,236.85 | SV4_GPR_2.29 130.81,113.03 v130.81,112.71 | v142.24,111.44 147.64,106.05 147.64,90.49 148.91,89.22 v148.91,80.33 | v158.43,80.33 158.75,80.01 158.75,69.22 v199.07,28.89 | v264.16,28.89 269.24,33.97 269.24,62.87 285.12,78.74 285.12,82.55 | 285.12,82.55 285.12,101.28 283.53,102.87 281.94,102.87 281.94,104.46 282.89,105.41 281.94,106.36 281.94,109.54 282.89,110.49 284.48,110.49 284.48,113.03 SV5_GPR_2.29 | v261.3,174.94 261.62,174.62 261.62,118.11 263.52,116.2 263.52,93.03 274,82.55 285.12,82.55
!GPR_D_ALU_LEFT_ASSERT  (via drill 0.35)
  Top 0.254: v284.48,236.22 SV2_GPR_2.28 | v283.53,295.91 286.07,298.45 SV1_GPR_2.28 | v127,56.2 147.96,56.2 149.86,54.29 v151.76,54.29 | v154.31,51.75 155.26,52.7 188.28,52.7 188.91,52.07 v213.68,52.07 | v214,111.12 214.95,112.08 v271.46,112.08 280.35,112.08 SV5_GPR_2.28 | v271.14,173.99 v275.59,173.99 SV3_GPR_2.28 | v284.48,225.74 283.53,224.79 v276.86,224.79
  Bottom 0.254: v283.53,295.91 283.53,286.7 284.8,285.43 284.8,236.54 v284.48,236.22 284.16,235.9 284.16,226.38 284.48,226.06 v284.48,225.74 | SV4_GPR_2.28 120.33,111.76 120.33,62.87 v127,56.2 | v154.31,51.75 v151.76,54.29 | v213.68,52.07 214,52.39 v214,111.12 | v271.14,173.99 271.14,148.27 272.73,146.69 272.73,126.05 272.1,125.41 272.1,120.02 271.78,119.7 271.78,112.39 v271.46,112.08 | v276.86,224.79 276.23,224.16 276.23,202.56 275.59,201.93 v275.59,173.99
!GPR_D_ALU_RIGHT_ASSERT  (via drill 0.35)
  Top 0.254: SV4_GPR_2.18 126.36,99.69 v114.62,99.69 | v114.62,59.69 114.94,59.37 133.67,59.37 133.99,59.05 143.83,59.05 144.46,59.69 v151.76,59.69 | v193.99,56.52 v154.94,56.52 | v197.17,83.82 268.61,83.82 v271.46,86.68 | SV3_GPR_2.18 293.05,161.61 v278.13,161.61 | SV5_GPR_2.18 v275.27,99.06 | SV2_GPR_2.18 293.05,223.2 v284.48,223.2 265.11,223.2 v259.08,229.24 | v280.67,208.91 v282.26,210.5 | v262.25,285.75 SV1_GPR_2.18
  Bottom 0.254: v114.62,99.69 114.94,99.38 114.94,60.01 v114.62,59.69 | v154.94,56.52 v151.76,59.69 | v193.99,56.52 197.17,59.69 v197.17,83.82 | v271.46,86.68 279.4,94.61 279.4,97.79 SV5_GPR_2.18 | v275.27,99.06 277.18,100.97 277.18,103.82 276.86,104.14 276.86,144.78 278.45,146.37 278.45,161.29 v278.13,161.61 278.13,162.88 278.76,163.51 278.76,170.5 279.08,170.81 279.08,188.91 280.04,189.87 280.04,208.28 v280.67,208.91 | v284.48,223.2 284.16,222.88 284.16,214.95 282.26,213.04 v282.26,210.5 | v262.25,285.75 261.3,284.8 261.3,280.04 259.08,277.81 v259.08,229.24
!GPR_D_ASSERT_MAIN_BUS  (via drill 0.35)
  Top 0.254: SV4_GPR_2.9 130.18,89.53 v138.43,89.53 | v166.37,44.77 166.69,45.09 202.88,45.09 206.69,48.9 214,48.9 215.9,50.8 v215.9,52.7 | v230.5,89.22 234,92.71 v245.75,92.71 283.53,92.71 284.48,91.76 284.48,88.9 SV5_GPR_2.9 | SV3_GPR_2.9 295.59,150.81 294.64,150.81 293.69,149.86 292.74,149.86 291.78,150.81 277.5,150.81 275.59,148.91 v254.95,148.91 v249.87,148.91 | SV2_GPR_2.9 295.59,213.04 294.64,213.04 293.69,212.09 289.56,212.09 288.93,212.72 v254.63,212.72 | SV1_GPR_2.9 296.23,275.27 v298.13,275.27 | v290.51,264.16 289.24,262.89 v255.27,262.89
  Bottom 0.254: v138.43,89.53 139.06,88.9 139.06,46.04 149.22,35.88 149.22,33.34 150.81,31.75 166.37,31.75 v166.37,44.77 | v215.9,52.7 230.5,67.31 v230.5,89.22 | v249.87,148.91 246.7,145.73 246.7,101.6 245.75,100.65 v245.75,92.71 | v254.95,148.91 254.95,212.41 v254.63,212.72 254.32,213.04 254.32,233.68 255.59,234.95 255.59,262.57 v255.27,262.89 | v298.13,275.27 297.18,274.32 297.18,270.19 296.23,269.24 290.51,269.24 v290.51,264.16
!GPR_D_LOAD  (via drill 0.35)
  Top 0.254: v290.51,235.27 v274.64,235.27 274,234.63 v267.65,234.63 | v278.45,286.7 278.76,287.02 296.55,287.02 v298.13,288.61 | v151.76,49.53 v137.16,49.53 | v163.51,51.75 163.83,51.44 196.53,51.44 197.17,50.8 v214.95,50.8 | v240.35,110.17 280.04,110.17 280.35,110.49 281.94,110.49 SV5_GPR_2.27 | SV3_GPR_2.27 294.64,172.72 292.42,172.72 291.78,172.09 276.23,172.09 275.91,172.4 272.42,172.4 270.51,170.5 v240.98,170.5 | v266.7,156.53 266.38,156.21 v240.35,156.21
  Bottom 0.254: SV2_GPR_2.27 295.59,236.54 295.59,237.49 294.64,238.44 294.64,239.08 293.69,240.03 292.42,240.03 292.42,240.35 291.46,241.3 290.51,241.3 v290.51,235.27 | v274.64,235.27 274.64,244.47 274,245.11 274,282.26 v278.45,286.7 | v298.13,288.61 297.81,288.93 297.81,296.55 SV1_GPR_2.27 | SV4_GPR_2.27 128.27,110.49 128.27,108.9 127.32,107.95 122.24,107.95 122.24,64.45 v137.16,49.53 | v151.76,49.53 155.26,46.04 163.51,46.04 v163.51,51.75 | v214.95,50.8 231.46,67.31 231.46,110.17 232.41,111.12 240.35,111.12 | v240.35,110.17 240.35,111.12 | v240.98,170.5 240.66,170.18 240.66,156.21 | 240.66,156.21 240.66,111.44 240.35,111.12 | v267.65,234.63 266.7,233.68 v266.7,156.53 | 240.66,156.21 v240.35,156.21
!GPR_X_ALU_LEFT_ASSERT  (via drill 0.35)
  Top 0.254: v285.12,233.68 SV2_GPR_2.26 | SV1_GPR_2.26 v286.7,295.91 | v125.41,56.83 125.73,57.15 147.64,57.15 149.54,55.24 v151.76,55.24 | v154.31,52.7 154.94,53.34 188.28,53.34 188.59,53.02 214.63,53.02 v214.95,52.7 | v229.55,108.27 230.5,109.22 v272.1,109.22 SV5_GPR_2.26 | SV3_GPR_2.26 v275.91,171.45 273.69,171.45 v272.73,170.5 | v284.16,202.88 283.21,201.93 v276.54,201.93
  Bottom 0.254: v286.7,295.91 284.16,293.37 284.16,286.7 285.43,285.43 285.43,234 v285.12,233.68 284.8,233.36 284.8,226.38 285.43,225.74 285.43,207.33 284.16,206.06 v284.16,202.88 | SV4_GPR_2.26 127.64,109.86 127.64,110.81 128.27,111.44 128.27,112.08 127.32,113.03 119.7,113.03 119.7,62.55 v125.41,56.83 | v154.31,52.7 v151.76,55.24 | v214.95,52.7 214.63,53.02 214.63,93.34 v229.55,108.27 | v272.73,170.5 272.73,147.32 273.37,146.69 273.37,120.65 272.42,119.7 272.42,109.54 v272.1,109.22 | v276.54,201.93 276.54,173.04 275.91,172.4 v275.91,171.45
!GPR_X_ALU_RIGHT_ASSERT  (via drill 0.35)
  Top 0.254: SV4_GPR_2.16 126.05,97.47 v113.98,97.47 | v151.76,47.62 v123.51,47.62 | v202.25,41.59 v157.8,41.59 | v207.96,85.72 217.17,94.93 v264.48,94.93 279.08,94.93 SV5_GPR_2.16 | v264.8,158.75 SV3_GPR_2.16 | SV2_GPR_2.16 292.74,221.62 283.53,221.62 283.21,221.93 265.11,221.93 v263.52,220.34 260.03,220.34 v258.13,222.25 | SV1_GPR_2.16 293.05,282.89 280.35,282.89 278.45,280.99 262.57,280.99 262.25,281.31 v260.35,281.31
  Bottom 0.254: v113.98,97.47 113.67,97.16 113.67,57.47 v123.51,47.62 | v157.8,41.59 v151.76,47.62 | v202.25,41.59 208.28,47.62 208.28,85.41 v207.96,85.72 | v264.48,94.93 264.48,158.43 v264.8,158.75 263.84,159.7 263.84,220.03 v263.52,220.34 | v260.35,281.31 258.13,279.08 v258.13,222.25
!GPR_X_ASSERT_MAIN_BUS  (via drill 0.35)
  Top 0.254: v125.73,73.34 126.68,72.39 v140.02,72.39 | v154.62,43.5 154.94,43.18 202.88,43.18 207.01,47.31 v232.09,47.31 | v233.68,85.72 235.59,87.63 281.94,87.63 SV5_GPR_2.7 | SV3_GPR_2.7 295.27,147.96 294.32,147.96 293.69,147.32 271.14,147.32 v270.51,146.69 259.4,146.69 v259.08,147 | v291.15,215.26 261.62,215.26 v260.67,214.31 | v289.56,268.29 287.34,266.06 v263.52,266.06
  Bottom 0.254: SV4_GPR_2.7 128.27,85.09 125.73,85.09 v125.73,73.34 | v140.02,72.39 143.51,68.9 143.51,54.61 v154.62,43.5 | v232.09,47.31 233.68,48.9 v233.68,85.72 | v270.51,146.69 266.38,142.56 266.38,90.81 272.42,84.77 280.04,84.77 280.35,85.09 283.21,85.09 SV5_GPR_2.7 | SV2_GPR_2.7 295.59,211.14 295.59,212.09 294.64,213.04 294.64,213.68 293.69,214.63 291.15,214.63 v291.15,215.26 | 260.67,212.41 260.67,187.96 259.08,186.37 v259.08,147 | 260.67,212.41 v260.67,214.31 | SV1_GPR_2.7 294.64,271.78 289.56,271.78 v289.56,268.29 | v263.52,266.06 262.57,265.11 262.57,214.31 260.67,212.41
!GPR_X_LOAD  (via drill 0.35)
  Top 0.254: SV4_GPR_2.25 129.86,108.9 143.83,108.9 v150.5,102.23 | v160.97,91.76 161.93,92.71 179.07,92.71 179.71,93.34 211.46,93.34 216.22,98.11 v218.44,98.11 | v227.65,107.31 279.72,107.31 280.35,107.95 281.94,107.95 SV5_GPR_2.25 | v240.98,188.59 v290.83,188.59 | v292.42,232.09 279.08,232.09 v278.13,231.14 269.24,231.14 v268.61,231.78 | v277.81,207.01 275.91,205.1 v240.98,205.1 | v300.36,295.91 SV1_GPR_2.25 | v294,313.69 293.69,314.01 v268.92,314.01
  Bottom 0.254: v150.5,102.23 151.13,101.6 151.13,92.71 159.07,84.77 160.02,84.77 160.02,90.81 v160.97,91.76 | v218.44,98.11 v227.65,107.31 228.92,108.58 228.92,176.53 v240.98,188.59 v240.98,205.1 | SV3_GPR_2.25 294.64,170.18 290.83,170.18 v290.83,188.59 | SV2_GPR_2.25 294.64,232.41 292.42,232.41 v292.42,232.09 | v278.13,231.14 277.81,230.82 v277.81,207.01 | v300.36,295.91 300.04,296.23 300.04,311.15 297.5,313.69 v294,313.69 | v268.92,314.01 268.61,313.69 v268.61,231.78
!RESERVED_ASSERT  (via drill 0.35)
  Top 0.254: SV4_GPR_2.5 129.86,84.14 v140.97,84.14 | v143.51,72.71 145.1,71.12 v150.81,71.12 | v154.94,58.42 155.26,58.1 189.55,58.1 v189.87,58.42 | v192.09,76.52 194.31,78.74 256.86,78.74 v260.35,82.23 260.67,82.55 281.94,82.55 SV5_GPR_2.5 | SV3_GPR_2.5 294.96,147 v294.32,147 | v291.78,146.37 v280.04,146.37 271.14,146.37 270.51,145.73 v260.67,145.73 | v281.62,208.91 291.15,208.91 291.78,209.55 293.69,209.55 294.64,208.6 295.59,208.6 SV2_GPR_2.5 298.13,208.28 v298.45,208.6 | SV1_GPR_2.5 296.23,270.83 v301.31,270.83 | v298.77,232.73 v301.62,232.73
  Bottom 0.254: v140.97,84.14 142.56,82.55 142.56,73.66 v143.51,72.71 | v150.81,71.12 150.81,62.55 v154.94,58.42 | v189.87,58.42 192.09,60.64 v192.09,76.52 | v294.32,147 294,147 293.69,147.32 291.78,147.32 v291.78,146.37 | v260.67,145.73 260.35,145.41 v260.35,82.23 | v281.62,208.91 280.67,207.96 280.67,190.5 281.62,189.55 281.62,180.66 280.35,179.39 280.35,170.81 280.04,170.5 v280.04,146.37 | v301.31,270.83 300.99,270.51 300.99,246.06 301.62,245.43 v301.62,232.73 | v298.77,232.73 298.45,232.41 v298.45,208.6
!RESERVERD_LOAD  (via drill 0.35)
  Top 0.254: SV3_GPR_2.23 294.64,170.18 294.64,172.09 294.96,172.09 295.59,172.72 297.81,172.72 300.67,175.58 v301.62,175.58 | v301.62,230.5 300.04,232.09 299.08,232.09 298.13,231.14 SV2_GPR_2.23 | v292.42,289.24 292.1,288.93 v281.31,288.93 | v291.46,234.63 291.15,234.31 290.51,234.31 290.19,234.63 280.99,234.63 v280.67,234.31 280.04,233.68 v255.27,233.68 | v142.24,106.68 SV4_GPR_2.23 | v147.96,80.96 148.27,81.28 153.99,81.28 154.31,80.96 v157.48,80.96 | v158.43,59.69 158.75,59.37 186.06,59.37 187.01,60.33 v246.7,60.33 | v251.46,104.78 252.09,105.41 280.99,105.41 282.26,106.68 SV5_GPR_2.23
  Bottom 0.254: v301.62,175.58 303.53,177.48 303.53,185.42 303.21,185.74 303.21,198.12 300.36,200.98 300.36,211.46 299.72,212.09 299.72,221.93 300.67,222.88 300.67,227.65 301.62,228.6 v301.62,230.5 | SV1_GPR_2.23 294.64,292.1 294.64,290.51 293.69,289.56 292.42,289.56 v292.42,289.24 | v281.31,288.93 280.99,288.61 280.99,237.17 280.67,236.85 v280.67,234.31 | v291.46,234.63 291.46,231.46 293.05,229.87 295.91,229.87 SV2_GPR_2.23 | v142.24,106.68 147,101.92 147,81.92 v147.96,80.96 | v157.48,80.96 157.48,65.72 158.43,64.77 v158.43,59.69 | 246.7,98.74 246.7,100.01 v251.46,104.78 | 246.7,98.74 v246.7,60.33 | v255.27,233.68 255.59,233.36 255.59,207.33 256.86,206.06 256.86,104.14 253.37,100.65 253.37,99.69 252.41,98.74 246.7,98.74
!RESET  (via drill 0.35)
  Top 0.254: v12.7,172.4 12.38,172.72 8.89,172.72 SV3_CREG_1.28 | SV2_CREG_1.28 8.89,234.95 v13.02,234.95 | SV2_GPR_1.12 184.47,213.68 v183.2,213.68 | v183.2,155.26 184.78,153.67 SV3_GPR_1.12 | v262.89,14.61 SV_XFER_2.10 | v251.14,84.77 203.2,84.77 197.8,90.17 175.9,90.17 174.62,91.44 SV5_GPR_1.12 | v183.83,277.81 186.37,277.81 SV1_GPR_1.12 187.96,276.86 196.85,276.86 v198.44,278.45 | SV_EXT_3.11 299.08,242.57 v297.5,244.16 | v294.64,249.24 293.69,248.28 291.78,248.28 291.15,247.65 223.84,247.65 211.14,260.35 v202.88,260.35 | SV4_GPR_1.12 21.59,90.17 93.03,90.17 100.33,82.87 v108.9,82.87 | v198.12,28.89 199.07,27.94 v251.14,27.94
  Bottom 0.254: SV4_GPR_1.12 17.78,93.98 17.78,144.46 12.7,149.54 v12.7,172.4 12.7,234.63 v13.02,234.95 13.34,235.27 13.34,302.26 9.84,302.26 8.89,301.31 8.89,299.72 SV_CREG_1.28 | SV5_GPR_1.12 175.26,92.71 175.26,94.3 176.21,95.25 183.51,95.25 183.51,150.81 186.37,153.67 SV3_GPR_1.12 | v183.2,155.26 v183.2,213.68 182.88,214 182.88,222.88 184.15,224.16 184.15,277.5 v183.83,277.81 | v262.89,14.61 251.14,26.35 v251.14,27.94 v251.14,84.77 | SV_CONST_REG_1.12 202.56,338.45 202.56,282.57 v198.44,278.45 201.61,275.27 201.61,261.62 v202.88,260.35 | v297.5,244.16 297.18,244.47 297.18,246.7 v294.64,249.24 | v108.9,82.87 111.12,80.64 111.12,50.8 133.03,28.89 v198.12,28.89
ADDRESS_BUS_0  (via drill 0.35)
  Top 0.254: SV2_CREG_2.33 170.18,244.47 168.91,245.75 168.91,247.65 | 168.91,247.65 168.91,248.6 172.4,248.6 173.35,249.56 173.35,258.13 164.47,267.02 164.47,269.24 170.5,269.24 171.45,270.19 171.45,306.07 SV_CREG_2.33 | v306.39,59.37 306.39,58.42 307.34,57.47 307.34,54.61 SV_EXT_1.4 | R33.1 v305.12,107.95 302.89,110.17 v285.12,110.17 | v12.06,140.97 53.66,182.56 150.81,182.56 | 150.81,182.56 v153.67,182.56 167,182.56 167.32,182.88 168.91,182.88 SV3_CREG_2.33 | v281.94,125.73 174.31,125.73 172.09,127.95 v171.13,127.95 | v169.54,108.9 169.23,108.58 v156.84,108.58 | 168.91,247.65 157.48,247.65 v152.4,242.57 | 150.81,182.56 v150.81,184.47
  Bottom 0.254: v305.12,107.95 306.39,106.68 v306.39,59.37 | SV_XFER_1.4 11.43,11.43 11.43,130.18 12.06,130.81 v12.06,140.97 | v285.12,110.17 285.43,110.49 285.43,122.24 v281.94,125.73 | v171.13,127.95 169.54,126.36 v169.54,108.9 | v156.84,108.58 147.64,117.79 147.64,131.13 147.32,131.44 147.32,145.73 150.81,149.22 150.81,179.71 v153.67,182.56 | v152.4,242.57 150.81,240.98 v150.81,184.47
ADDRESS_BUS_1  (via drill 0.35)
  Top 0.254: v305.12,105.41 R34.1 | v304.8,53.34 307.34,53.34 SV_EXT_1.6 | v14.92,142.88 50.8,178.75 v106.05,178.75 140.34,178.75 140.65,179.07 145.73,179.07 | 145.73,179.07 166.05,179.07 167.32,177.8 168.91,177.8 SV3_CREG_2.31 | SV2_CREG_2.31 168.91,240.03 152.08,240.03 v146.05,234 | 145.73,179.07 v145.73,179.39 | v285.43,64.77 v304.48,64.77 | v158.43,36.83 v280.04,36.83 | v141.92,53.34 112.39,53.34 v106.05,59.69
  Bottom 0.254: v305.12,105.41 305.12,67.63 304.17,66.67 304.17,64.77 | 304.17,64.77 304.17,53.98 v304.8,53.34 | SV_XFER_1.6 13.97,11.43 13.97,95.89 15.24,97.16 15.24,142.56 v14.92,142.88 | 146.05,225.74 146.05,179.71 v145.73,179.39 | 146.05,225.74 v146.05,234 | SV_CREG_2.31 171.45,304.8 171.45,306.39 170.5,307.34 168.91,307.34 168.91,308.93 167.96,309.88 161.29,309.88 161.29,300.99 152.72,292.42 152.72,243.84 150.18,241.3 150.18,229.87 146.05,225.74 | v304.48,64.77 304.17,64.77 | v285.43,64.77 281.94,61.28 281.94,38.73 v280.04,36.83 | v141.92,53.34 v158.43,36.83 | v106.05,178.75 v106.05,59.69
ADDRESS_BUS_2  (via drill 0.35)
  Top 0.254: v305.44,50.8 307.34,50.8 SV_EXT_1.8 | R35.1 305.75,103.5 v304.17,103.5 299.08,108.58 v290.19,108.58 | v15.88,142.88 49.53,176.53 v137.79,176.53 | v139.06,175.26 139.38,174.94 167,174.94 167.32,175.26 168.91,175.26 SV3_CREG_2.29 | SV2_CREG_2.29 168.91,237.49 v153.35,237.49 150.5,237.49 v140.34,227.33 | v284.16,181.93 283.53,182.56 v214.63,182.56 | v210.19,196.85 209.87,196.53 176.21,196.53 173.99,194.31 v173.99,190.82
  Bottom 0.254: v304.17,103.5 304.48,103.19 304.48,67.63 303.53,66.67 303.53,52.7 v305.44,50.8 | SV_XFER_1.8 16.51,11.43 16.51,93.98 15.88,94.61 v15.88,142.88 | v139.06,175.26 v137.79,176.53 137.79,177.48 140.34,180.02 v140.34,227.33 | SV_CREG_2.29 168.91,302.26 168.91,306.39 167.96,307.34 165.42,307.34 165.42,304.48 153.35,292.42 v153.35,237.49 | v290.19,108.58 290.51,108.9 290.51,127.64 284.16,133.99 v284.16,181.93 | v214.63,182.56 210.19,187.01 v210.19,196.85 | v173.99,190.82 168.91,185.74 168.91,177.8 SV3_CREG_2.29
ADDRESS_BUS_3  (via drill 0.35)
  Top 0.254: SV2_CREG_2.27 168.91,234.95 v155.26,234.95 153.35,233.04 147,233.04 v139.38,225.43 | v154.31,287.65 163.83,297.18 168.91,297.18 SV_CREG_2.27 | v303.53,98.74 R36.1 | v302.26,48.26 307.34,48.26 SV_EXT_1.10 | v16.83,140.97 45.09,169.23 v133.67,169.23 v151.76,169.23 | v153.67,171.13 155.26,172.72 168.91,172.72 SV3_CREG_2.27 | v302.26,20.64 300.67,19.05 169.54,19.05 169.23,18.73 165.74,18.73 v165.42,19.05 | v101.6,16.83 92.08,7.3 v59.69,7.3 | v51.12,17.14 50.8,16.83 19.05,16.83 17.78,15.56 SV_XFER_1.10